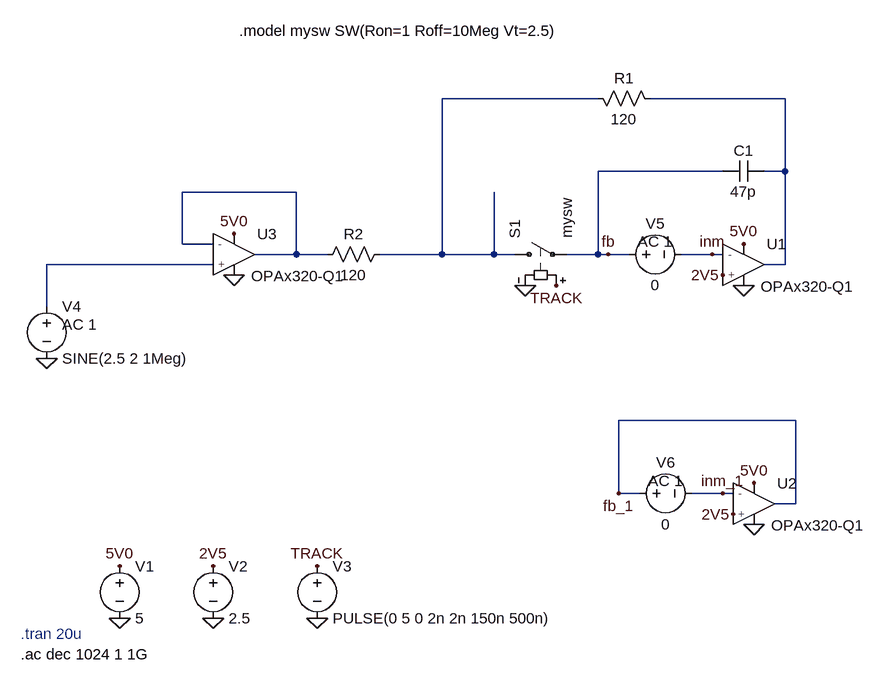
[diagram p0: schematic SampleAndHold.asc]
SampleAndHold.asc, the LTspice schematic file:
Version 4.1
SHEET 1 1376 680
WIRE 960 -384 720 -384
WIRE 1248 -384 1040 -384
WIRE 1152 -272 960 -272
WIRE 1248 -272 1248 -384
WIRE 1248 -272 1216 -272
WIRE 496 -240 320 -240
WIRE 320 -160 320 -240
WIRE 368 -160 320 -160
WIRE 496 -144 496 -240
WIRE 496 -144 432 -144
WIRE 544 -144 496 -144
WIRE 720 -144 720 -384
WIRE 720 -144 624 -144
WIRE 800 -144 800 -240
WIRE 800 -144 720 -144
WIRE 832 -144 800 -144
WIRE 960 -144 960 -272
WIRE 960 -144 912 -144
WIRE 976 -144 960 -144
WIRE 1008 -144 976 -144
WIRE 1136 -144 1088 -144
WIRE 1152 -144 1136 -144
WIRE 368 -128 112 -128
WIRE 1248 -128 1248 -272
WIRE 1248 -128 1216 -128
WIRE 112 -64 112 -128
WIRE 1264 112 992 112
WIRE 992 224 992 112
WIRE 1024 224 992 224
WIRE 1152 224 1104 224
WIRE 1168 224 1152 224
WIRE 1264 240 1264 112
WIRE 1264 240 1232 240
FLAG 528 416 0
FLAG 368 416 0
FLAG 224 416 0
FLAG 224 336 5V0
FLAG 368 336 2V5
FLAG 528 336 TRACK
FLAG 112 16 0
FLAG 400 -112 0
FLAG 400 -176 5V0
FLAG 1184 -96 0
FLAG 1184 -160 5V0
FLAG 848 -96 0
FLAG 896 -96 TRACK
FLAG 1152 -112 2V5
FLAG 976 -144 fb
FLAG 1136 -144 inm
FLAG 1200 272 0
FLAG 1200 208 5V0
FLAG 1168 256 2V5
FLAG 992 224 fb_1
FLAG 1152 224 inm_1
SYMBOL voltage 224 320 R0
WINDOW 123 0 0 Left 0
WINDOW 39 0 0 Left 0
SYMATTR InstName V1
SYMATTR Value 5
SYMBOL voltage 368 320 R0
WINDOW 123 0 0 Left 0
WINDOW 39 0 0 Left 0
SYMATTR InstName V2
SYMATTR Value 2.5
SYMBOL voltage 528 320 R0
WINDOW 123 0 0 Left 0
WINDOW 39 0 0 Left 0
SYMATTR InstName V3
SYMATTR Value PULSE(0 5 0 2n 2n 150n 500n)
SYMBOL voltage 112 -80 R0
WINDOW 123 24 44 Left 2
WINDOW 39 0 0 Left 0
SYMATTR Value2 AC 1
SYMATTR InstName V4
SYMATTR Value SINE(2.5 2 1Meg)
SYMBOL cap 1152 -288 M90
WINDOW 0 0 32 VBottom 2
WINDOW 3 32 32 VTop 2
SYMATTR InstName C1
SYMATTR Value 47p
SYMBOL res 944 -400 M90
WINDOW 0 0 56 VBottom 2
WINDOW 3 32 56 VTop 2
SYMATTR InstName R1
SYMATTR Value 120
SYMBOL sw 816 -144 R270
SYMATTR InstName S1
SYMATTR Value mysw
SYMBOL res 640 -160 R90
WINDOW 0 0 56 VBottom 2
WINDOW 3 32 56 VTop 2
SYMATTR InstName R2
SYMATTR Value 120
SYMBOL voltage 992 -144 R270
WINDOW 0 32 56 VTop 2
WINDOW 3 -32 56 VBottom 2
WINDOW 123 4 56 VTop 2
WINDOW 39 0 0 Left 0
SYMATTR InstName V5
SYMATTR Value 0
SYMATTR Value2 AC 1
SYMBOL OPAx320-Q1 432 -144 R0
SYMATTR InstName U3
SYMBOL OPAx320-Q1 1216 -128 R0
SYMATTR InstName U1
SYMBOL voltage 1008 224 R270
WINDOW 0 32 56 VTop 2
WINDOW 3 -32 56 VBottom 2
WINDOW 123 4 56 VTop 2
WINDOW 39 0 0 Left 0
SYMATTR InstName V6
SYMATTR Value 0
SYMATTR Value2 AC 1
SYMBOL OPAx320-Q1 1232 240 R0
SYMATTR InstName U2
TEXT 72 440 Left 2 ;.tran 20u
TEXT 408 -488 Left 2 !.model mysw SW(Ron=1 Roff=10Meg Vt=2.5)
TEXT 72 472 Left 2 !.ac dec 1024 1 1G

The netlist it stands for:
* SampleAndHold.asc
V1 5V0 0 5
V2 2V5 0 2.5
V3 TRACK 0 PULSE(0 5 0 2n 2n 150n 500n)
V4 N004 0 SINE(2.5 2 1Meg) AC 1
C1 fb N002 47p
R1 N001 N002 120
S1 N001 fb TRACK 0 mysw
R2 N001 N003 120
V5 fb inm 0 AC 1
X§U3 N004 N003 5V0 0 N003 OPAx320-Q1  ; pins + - VCC VEE OUT
X§U1 2V5 inm 5V0 0 N002 OPAx320-Q1  ; pins + - VCC VEE OUT
V6 fb_1 inm_1 0 AC 1
X§U2 2V5 inm_1 5V0 0 fb_1 OPAx320-Q1  ; pins + - VCC VEE OUT
* .tran 20u
.model mysw SW(Ron=1 Roff=10Meg Vt=2.5)
.ac dec 1024 1 1G
.lib D:\Personal Projects\Pipelined-ADC\Simulations\SampleAndHold\OPAx320-Q1.LIB
.backanno
.end